# EAGLE design 5V Battery Power Supply (EAGLE 7.4.0)
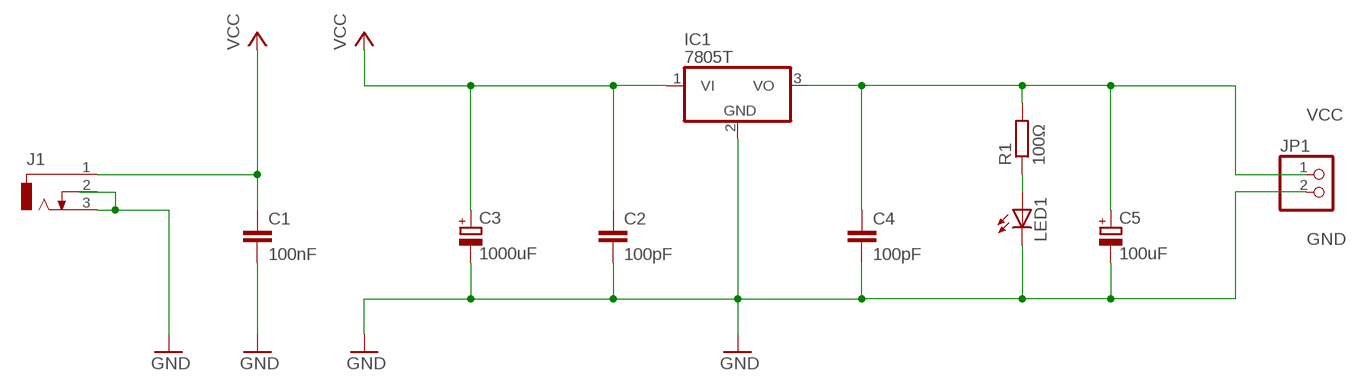
[diagram p0: schematic, sheet 1]

## Parts
C1  100nF  C-EU025-050X050  [C025-050X050]
C2  100pF  C-EU025-050X050  [C025-050X050]
C3  1000uF  CPOL-EUE2-5  [E2-5]
C4  100pF  C-EU025-050X050  [C025-050X050]
C5  100uF  CPOL-EUE2-5  [E2-5]
IC1  7805T  [TO220H]
J1  DCJ0303  [DCJ0303]
JP1  PINHD-1X2  [1X02]
LED1  LED5MM  [LED5MM]
R1  100Ω  R-EU_0207/7  [0207/7]

## Nets
GND: C1.2 C2.2 C3.- C4.2 C5.- IC1.2(GND) J1.3 JP1.2 LED1.K(C)
N$2: LED1.A R1.1
VCC: C1.1 C2.1 C3.+ C4.1 C5.+ IC1.1(VI) IC1.3(VO) J1.1 JP1.1 R1.2
Unconnected: J1.2

## Library data of the parts
C1 C2 C4 = rcl:C-EU: CAPACITOR, European symbol
C3 C5 = resistor:CPOL-EU: POLARIZED CAPACITOR, European symbol
IC1 = linear:78*: Positive VOLTAGE REGULATOR Source: http://cache.national.com/ds/LM/LM78L05.pdf http://www.fairchildsemi.com/ds/LM/LM7805.pdf
J1 = con-jack:DCJ0303: DC POWER JACK Source: DCJ0303.pdf; OC_FARNELL: unknown; OC_NEWARK: unknown
JP1 = pinhead:PINHD-1X2: PIN HEADER
LED1 = led:LED: LED OSRAM: - CHIPLED LG R971, LG N971, LY N971, LG Q971, LY Q971, LO R971, LY R971 LH N974, LH R974 LS Q976, LO Q976, LY Q976 LO Q996 - Hyper CHIPLED LW Q18S LB Q993, LB Q99A, LB R99A - SideLED LS A670, LO A670, LY A670, LG A670, LP A670 LB A673, LV A673, LT A673, LW A673 LH A674 LY A675 LS A676, LA A676, LO A676, LY A676, LW A676 LS A679, LY A679, LG A679 - Hyper Micro SIDELED® LS Y876, LA Y876, LO Y876, LY Y876 LT Y87S - SmartLED LW L88C, LW L88S LB L89C, LB L89S, LG L890 LS L89K, LO L89K, LY L89K LS L896, LA L896, LO L896, LY L896 - TOPLED LS T670, LO T670, LY T670, LG T670, LP T670 LSG T670, LSP T670, LSY T670, LOP T670, LYG T670 LG T671, LOG T671, LSG T671 LB T673, LV T673, LT T673, LW T673 LH T674 LS T676, LA T676, LO T676, LY T676, LB T676, LH T676, LSB T676, LW T676 LB T67C, LV T67C, LT T67C, LS T67K, LO T67K, LY T67K, LW E67C LS E67B, LA E67B, LO E67B, LY E67B, LB E67C, LV E67C, LT E67C LW T67C LS T679, LY T679, LG T679 LS T770, LO T770, LY T770, LG T770, LP T770 LB T773, LV T773, LT T773, LW T773 LH T774 LS E675, LA E675, LY E675, LS T675 LS T776, LA T776, LO T776, LY T776, LB T776 LHGB T686 LT T68C, LB T68C - Hyper Mini TOPLED® LB M676 - Mini TOPLED Santana® LG M470 LS M47K, LO M47K, LY M47K Source: http://www.osram.convergy.de LUXEON: - LUMILED® LXK2-PW12-R00, LXK2-PW12-S00, LXK2-PW14-U00, LXK2-PW14-V00 LXK2-PM12-R00, LXK2-PM12-S00, LXK2-PM14-U00 LXK2-PE12-Q00, LXK2-PE12-R00, LXK2-PE12-S00, LXK2-PE14-T00, LXK2-PE14-U00 LXK2-PB12-K00, LXK2-PB12-L00, LXK2-PB12-M00, LXK2-PB14-N00, LXK2-PB14-P00, LXK2-PB14-Q00 LXK2-PR12-L00, LXK2-PR12-M00, LXK2-PR14-Q00, LXK2-PR14-R00 LXK2-PD12-Q00, LXK2-PD12-R00, LXK2-PD12-S00 LXK2-PH12-R00, LXK2-PH12-S00 LXK2-PL12-P00, LXK2-PL12-Q00, LXK2-PL12-R00 Source: www.luxeon.com KINGBRIGHT: KA-3528ASYC Source: www.kingbright.com
R1 = resistor:R-EU_: RESISTOR, European symbol

## Board
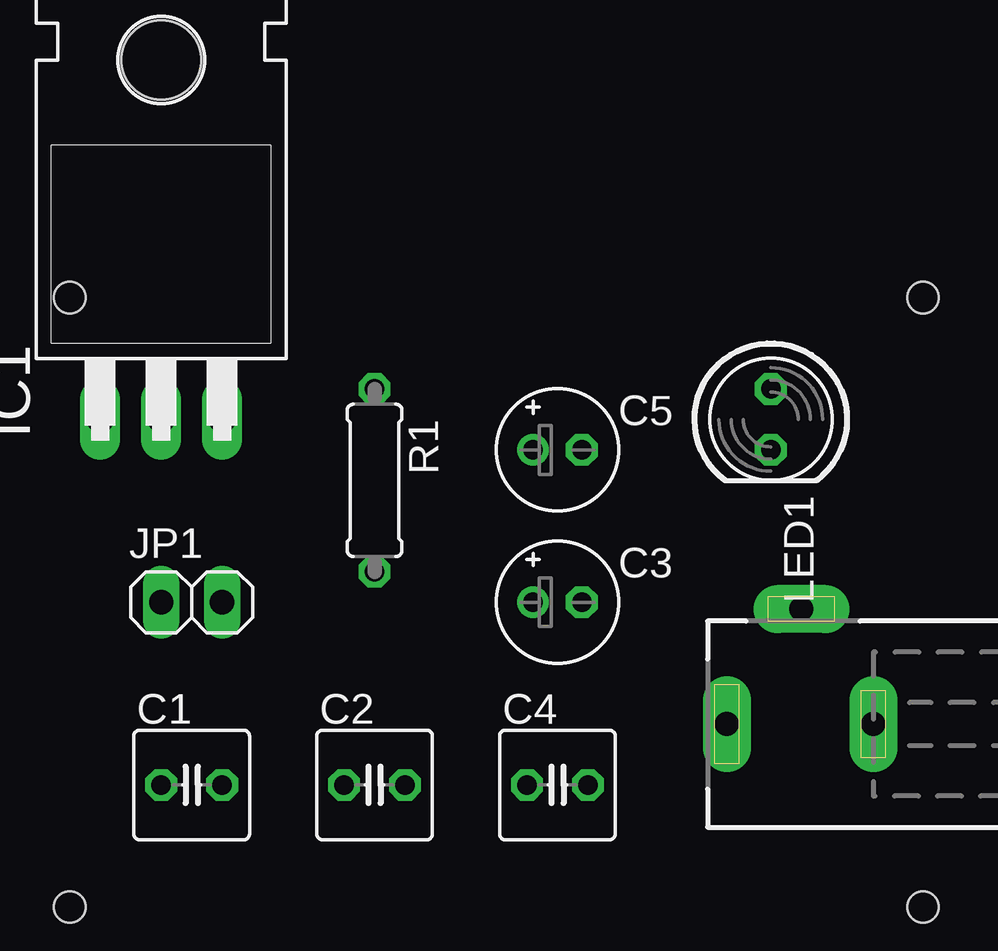
[diagram p1: board, top side]
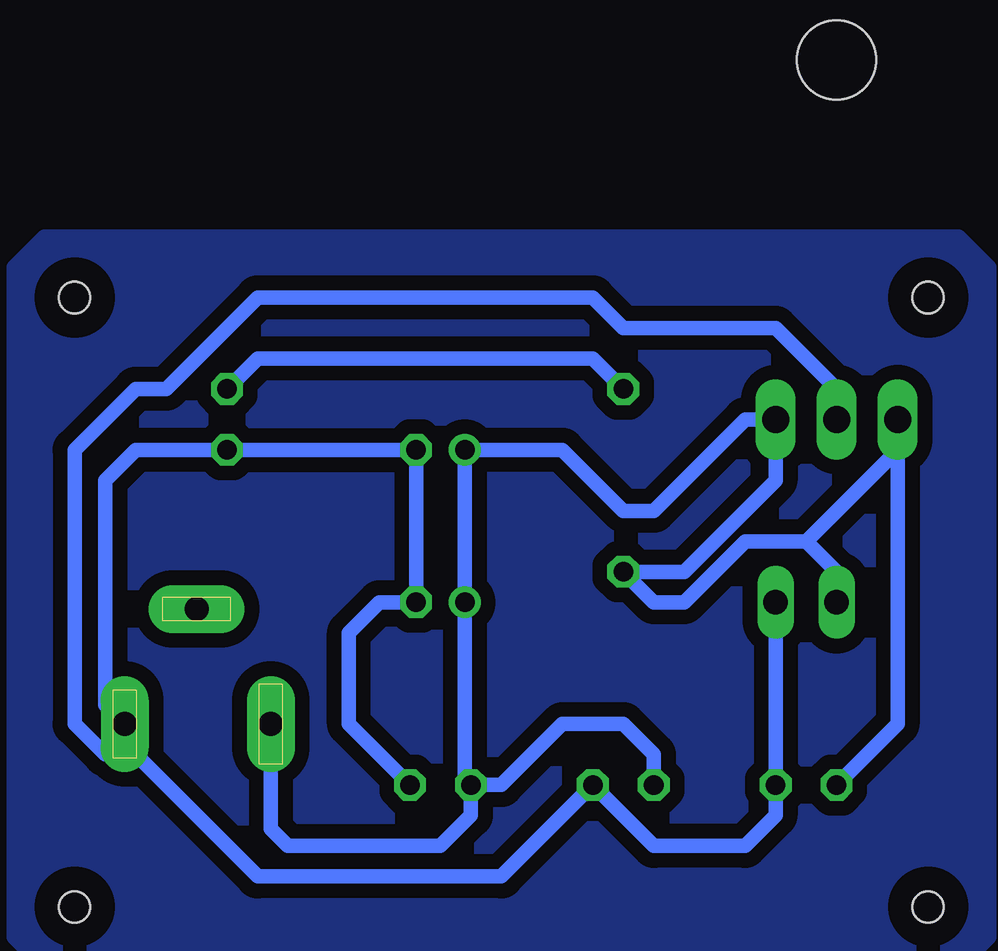
[diagram p2: board, bottom side, seen from below]

No outline drawn. Coordinates in mm, seen from the top.
Copper layers (1*16): Top 0.035mm / dielectric 1.5mm / Bottom 0.035mm
Design rules "default": minimum track width 10mil, minimum drill 24mil, track to track 8mil, track to pad 8mil, pad to pad 8mil, via to via 8mil, smd to smd 8mil, copper to edge 40mil, drill to drill 8mil, minimum pad ring 10mil, minimum via ring 8mil, stop-mask expansion 4mil, vias tented up to drill 0mil, thermal gap 10mil
Holes 1.3 mm at 90.17,54.61 125.73,54.61 125.73,29.21 90.17,29.21

### Footprints (pad centres in the part's own frame; a part is rotated, then mirrored left to right if it is on the bottom)
C025-050X050 = drill 0.813 octagon: 1 -1.27,0; 2 1.27,0
E2-5 = drill 0.813 pad 1.27: + -1.016,0 | drill 0.813 pad 1.27 octagon: - 1.016,0
TO220H = drill 1.118 long: 1 -2.54,-10.16; 2 0,-10.16; 3 2.54,-10.16 | hole 3.302: 0,4.826
DCJ0303 = drill 1 pad 2 long: 1 0,3.1; 2 4.8,0; 3 0,-3
1X02 = drill 1.016 long: 1 -1.27,0; 2 1.27,0
LED5MM = drill 0.813 octagon: A -1.27,0; K 1.27,0
0207/7 = drill 0.813 octagon: 1 -3.81,0; 2 3.81,0

### Placement (x,y rotation side)
C1  95.25,34.29 0 top
C2  102.87,34.29 0 top
C3  110.49,41.91 0 top
C4  110.49,34.29 0 top
C5  110.49,48.26 0 top
IC1  93.98,59.69 0 top
J1  120.65,36.83 90 top
JP1  95.25,41.91 0 top
LED1  119.38,49.53 270 top
R1  102.87,46.99 270 top

### Tracks (layer width: path | path; a pad name or v marks a point on that pad's centre or on a via)
GND
  Bottom 0.61: IC1.2 93.98,50.8 96.52,53.34 102.87,53.34 104.14,54.61 118.11,54.61 121.92,50.8 123.19,50.8 125.73,48.26 125.73,36.83 124.46,35.56 123.19,35.56 | 123.19,35.56 123.19,36.37 J1.3 124.46,37.64 124.46,46.99 123.19,48.26 LED1.K C5.- C3.- 113.03,41.91 114.3,40.64 114.3,36.83 C4.2 | 123.19,35.56 118.11,30.48 107.95,30.48 C2.2 101.6,31.75 97.79,31.75 96.52,33.02 C1.2 JP1.2
N$1
  pour Bottom (isolate 0.61): 87.63,34.29 87.63,27.94 88.9,26.67 127,26.67 128.27,27.94 128.27,55.88 127,57.15 88.9,57.15 87.63,55.88
N$2
  Bottom 0.61: R1.1 104.14,52.07 118.11,52.07 LED1.A
VCC
  Bottom 0.61: C1.1 91.44,36.83 IC1.1 91.44,48.26 95.25,44.45 | J1.1 117.55,32.46 116.84,31.75 110.49,31.75 109.22,33.02 C4.1 | C4.1 109.47,34.54 C3.+ C5.+ 105.41,48.26 102.87,45.72 101.6,45.72 97.79,49.53 IC1.3 96.52,46.99 100.33,43.18 R1.2 101.6,41.91 100.33,41.91 97.79,44.45 95.25,44.45 | C4.1 107.95,34.29 105.41,36.83 102.87,36.83 101.6,35.56 C2.1 | JP1.1 93.98,43.18 95.25,44.45